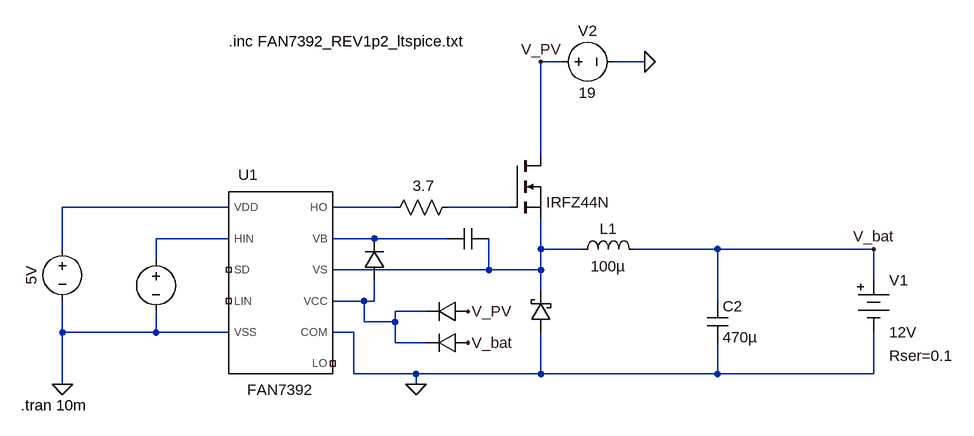
[diagram p0: schematic modified_Bootstrapping.asc]
modified_Bootstrapping.asc, the LTspice schematic file:
Version 4
SHEET 1 2256 680
WIRE 640 -176 608 -176
WIRE 768 -176 720 -176
WIRE 608 -32 608 -176
WIRE 128 48 -128 48
WIRE 384 48 288 48
WIRE 560 48 464 48
WIRE 128 96 16 96
WIRE 352 96 288 96
WIRE 464 96 352 96
WIRE -128 112 -128 48
WIRE 608 112 608 64
WIRE 672 112 608 112
WIRE 880 112 752 112
WIRE 1120 112 880 112
WIRE 16 128 16 96
WIRE 528 144 528 96
WIRE 528 144 288 144
WIRE 608 144 608 112
WIRE 608 144 528 144
WIRE 1120 160 1120 112
WIRE 608 176 608 144
WIRE 336 192 288 192
WIRE 352 192 352 160
WIRE 352 192 336 192
WIRE 880 192 880 112
WIRE 432 208 384 208
WIRE 336 224 336 192
WIRE 384 224 384 208
WIRE 384 224 336 224
WIRE -128 240 -128 192
WIRE 16 240 16 208
WIRE 16 240 -128 240
WIRE 128 240 16 240
WIRE 320 240 288 240
WIRE 384 256 384 224
WIRE 432 256 384 256
WIRE 320 304 320 240
WIRE 416 304 320 304
WIRE 608 304 608 240
WIRE 608 304 416 304
WIRE 880 304 880 256
WIRE 880 304 608 304
WIRE 1120 304 1120 240
WIRE 1120 304 880 304
WIRE -128 320 -128 240
WIRE 416 320 416 304
FLAG 416 320 0
FLAG 768 -176 0
FLAG -128 320 0
FLAG 608 -176 V_PV
FLAG 1120 112 V_bat
FLAG 496 256 V_bat
FLAG 496 208 V_PV
SYMBOL Gate\ drivers\\FAN7392 208 160 R0
SYMATTR InstName U1
SYMBOL nmos 560 -32 R0
WINDOW 0 56 32 Invisible 2
SYMATTR InstName M1
SYMATTR Value IRFZ44N
SYMBOL res 480 32 R90
WINDOW 0 0 56 Invisible 2
WINDOW 3 -33 52 VTop 2
SYMATTR InstName R1
SYMATTR Value 3.7
SYMBOL ind 656 128 R270
WINDOW 0 32 56 VTop 2
WINDOW 3 5 56 VBottom 2
SYMATTR InstName L1
SYMATTR Value 100µ
SYMBOL cap 528 80 R90
WINDOW 0 0 32 Invisible 2
WINDOW 3 32 32 Invisible 2
SYMATTR InstName C1
SYMATTR Value 1µF
SYMBOL voltage 624 -176 R270
WINDOW 0 32 56 VTop 2
WINDOW 3 -32 56 VBottom 2
WINDOW 123 0 0 Left 0
WINDOW 39 0 0 Left 0
SYMATTR InstName V2
SYMATTR Value 19
SYMBOL voltage -128 96 R0
WINDOW 0 32 56 Invisible 2
WINDOW 3 -32 56 VBottom 2
WINDOW 123 0 0 Left 0
WINDOW 39 0 0 Left 0
SYMATTR InstName V3
SYMATTR Value 5V
SYMBOL voltage 16 112 R0
WINDOW 0 24 16 Invisible 2
WINDOW 3 24 96 Invisible 2
WINDOW 123 0 0 Left 0
WINDOW 39 0 0 Left 0
SYMATTR InstName V4
SYMATTR Value PULSE(0 5v 1n 1n 1n 13u 20u)
SYMBOL cap 864 192 R0
SYMATTR InstName C2
SYMATTR Value 470µ
SYMBOL diode 368 160 R180
WINDOW 0 24 64 Invisible 2
WINDOW 3 24 0 Invisible 2
SYMATTR InstName D1
SYMATTR Value 1N4148
SYMBOL schottky 624 240 R180
WINDOW 0 24 64 Invisible 2
WINDOW 3 24 0 Invisible 2
SYMATTR InstName D2
SYMATTR Value SS3P5
SYMATTR Description Diode
SYMATTR Type diode
SYMBOL Misc\\battery 1120 144 R0
WINDOW 123 0 0 Left 0
WINDOW 39 24 132 Left 2
SYMATTR SpiceLine Rser=0.1
SYMATTR InstName V1
SYMATTR Value 12V
SYMBOL diode 496 192 R90
WINDOW 0 0 32 Invisible 2
WINDOW 3 32 32 Invisible 2
SYMATTR InstName D3
SYMBOL diode 496 240 R90
WINDOW 0 0 32 Invisible 2
WINDOW 3 32 32 Invisible 2
SYMATTR InstName D4
TEXT -192 352 Left 2 !.tran 10m
TEXT 128 -208 Left 2 !.inc FAN7392_REV1p2_ltspice.txt

The netlist it stands for:
* modified_Bootstrapping.asc
XU1 N007 0 N004 NC_01 N001 N005 N006 N002 0 NC_02 NC_03 FAN7392  ; pins VCC COM HIN LIN VDD VB VS HO VSS SD LO
M1 V_PV N003 N006 N006 IRFZ44N
R1 N003 N002 3.7
L1 N006 V_bat 100µ
C1 N006 N005 1µF
V2 V_PV 0 19
V3 N001 0 5V
V4 N004 0 PULSE(0 5v 1n 1n 1n 13u 20u)
C2 V_bat 0 470µ
D1 N007 N005 1N4148
D2 0 N006 SS3P5
V1 V_bat 0 12V Rser=0.1
D3 V_PV N007 D
D4 V_bat N007 D
.model D D
.lib standard.dio
.model NMOS NMOS
.model PMOS PMOS
.lib standard.mos
.tran 10m
.inc FAN7392_REV1p2_ltspice.txt
.backanno
.end